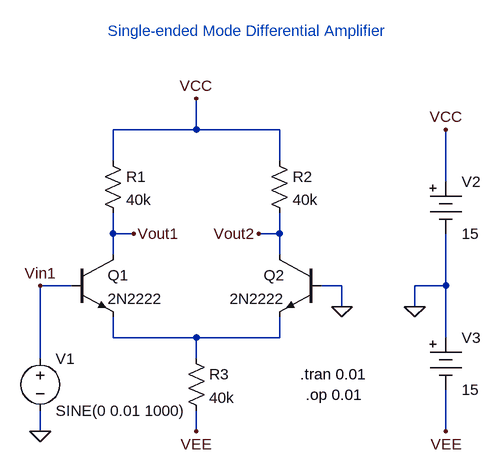
[diagram p0: schematic 2EEB_VELASCO_EXPT10_CKT1.asc]
2EEB_VELASCO_EXPT10_CKT1.asc, the LTspice schematic file:
Version 4
SHEET 1 880 680
WIRE 272 0 272 -48
WIRE 272 0 144 0
WIRE 400 0 272 0
WIRE 144 48 144 0
WIRE 400 48 400 0
WIRE 656 80 656 0
WIRE 144 160 144 128
WIRE 176 160 144 160
WIRE 400 160 400 128
WIRE 400 160 368 160
WIRE 144 192 144 160
WIRE 400 192 400 160
WIRE 80 240 32 240
WIRE 496 240 464 240
WIRE 656 240 656 160
WIRE 656 240 608 240
WIRE 496 272 496 240
WIRE 608 272 608 240
WIRE 144 320 144 288
WIRE 272 320 144 320
WIRE 400 320 400 288
WIRE 400 320 272 320
WIRE 656 320 656 240
WIRE 32 352 32 240
WIRE 272 352 272 320
WIRE 32 464 32 432
WIRE 272 464 272 432
WIRE 656 464 656 400
FLAG 272 -48 VCC
FLAG 272 464 VEE
FLAG 496 272 0
FLAG 32 464 0
FLAG 176 160 Vout1
FLAG 368 160 Vout2
FLAG 608 272 0
FLAG 656 0 VCC
FLAG 656 464 VEE
FLAG 32 240 Vin1
SYMBOL res 128 32 R0
SYMATTR InstName R1
SYMATTR Value 40k
SYMBOL npn 80 192 R0
SYMATTR InstName Q1
SYMATTR Value 2N2222
SYMBOL res 384 32 R0
SYMATTR InstName R2
SYMATTR Value 40k
SYMBOL npn 464 192 M0
SYMATTR InstName Q2
SYMATTR Value 2N2222
SYMBOL res 256 336 R0
SYMATTR InstName R3
SYMATTR Value 40k
SYMBOL voltage 32 336 R0
SYMATTR InstName V1
SYMATTR Value SINE(0 0.01 1000)
SYMBOL Misc\\battery 656 64 R0
SYMATTR InstName V2
SYMATTR Value 15
SYMBOL Misc\\battery 656 304 R0
SYMATTR InstName V3
SYMATTR Value 15
TEXT 432 376 Left 2 !.tran 0.01
TEXT 440 408 Left 2 !.op 0.01
TEXT 136 -152 Left 2 ;Single-ended Mode Differential Amplifier

The netlist it stands for:
* 2EEB_VELASCO_EXPT10_CKT1.asc
R1 VCC Vout1 40k
Q1 Vout1 Vin1 N001 0 2N2222
R2 VCC Vout2 40k
Q2 Vout2 0 N001 0 2N2222
R3 N001 VEE 40k
V1 Vin1 0 SINE(0 0.01 1000)
V2 VCC 0 15
V3 0 VEE 15
.model NPN NPN
.model PNP PNP
.lib standard.bjt
.tran 0.01
.op 0.01
* Single-ended Mode Differential Amplifier
.backanno
.end